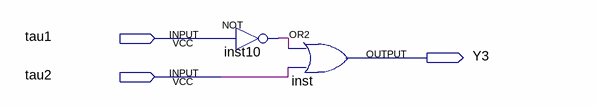
[diagram p0: schematic sheet]
// Quartus schematic Block7.bdf as structural Verilog: 2 symbols, 3 pins
module Block7 (
  input  tau1,
  input  tau2,
  output Y3
);

  wire inst10_out;

  not inst10 (inst10_out, tau1);
  or inst (Y3, inst10_out, tau2);
endmodule
